# EAGLE design tubeamplights (EAGLE 9.4.2)
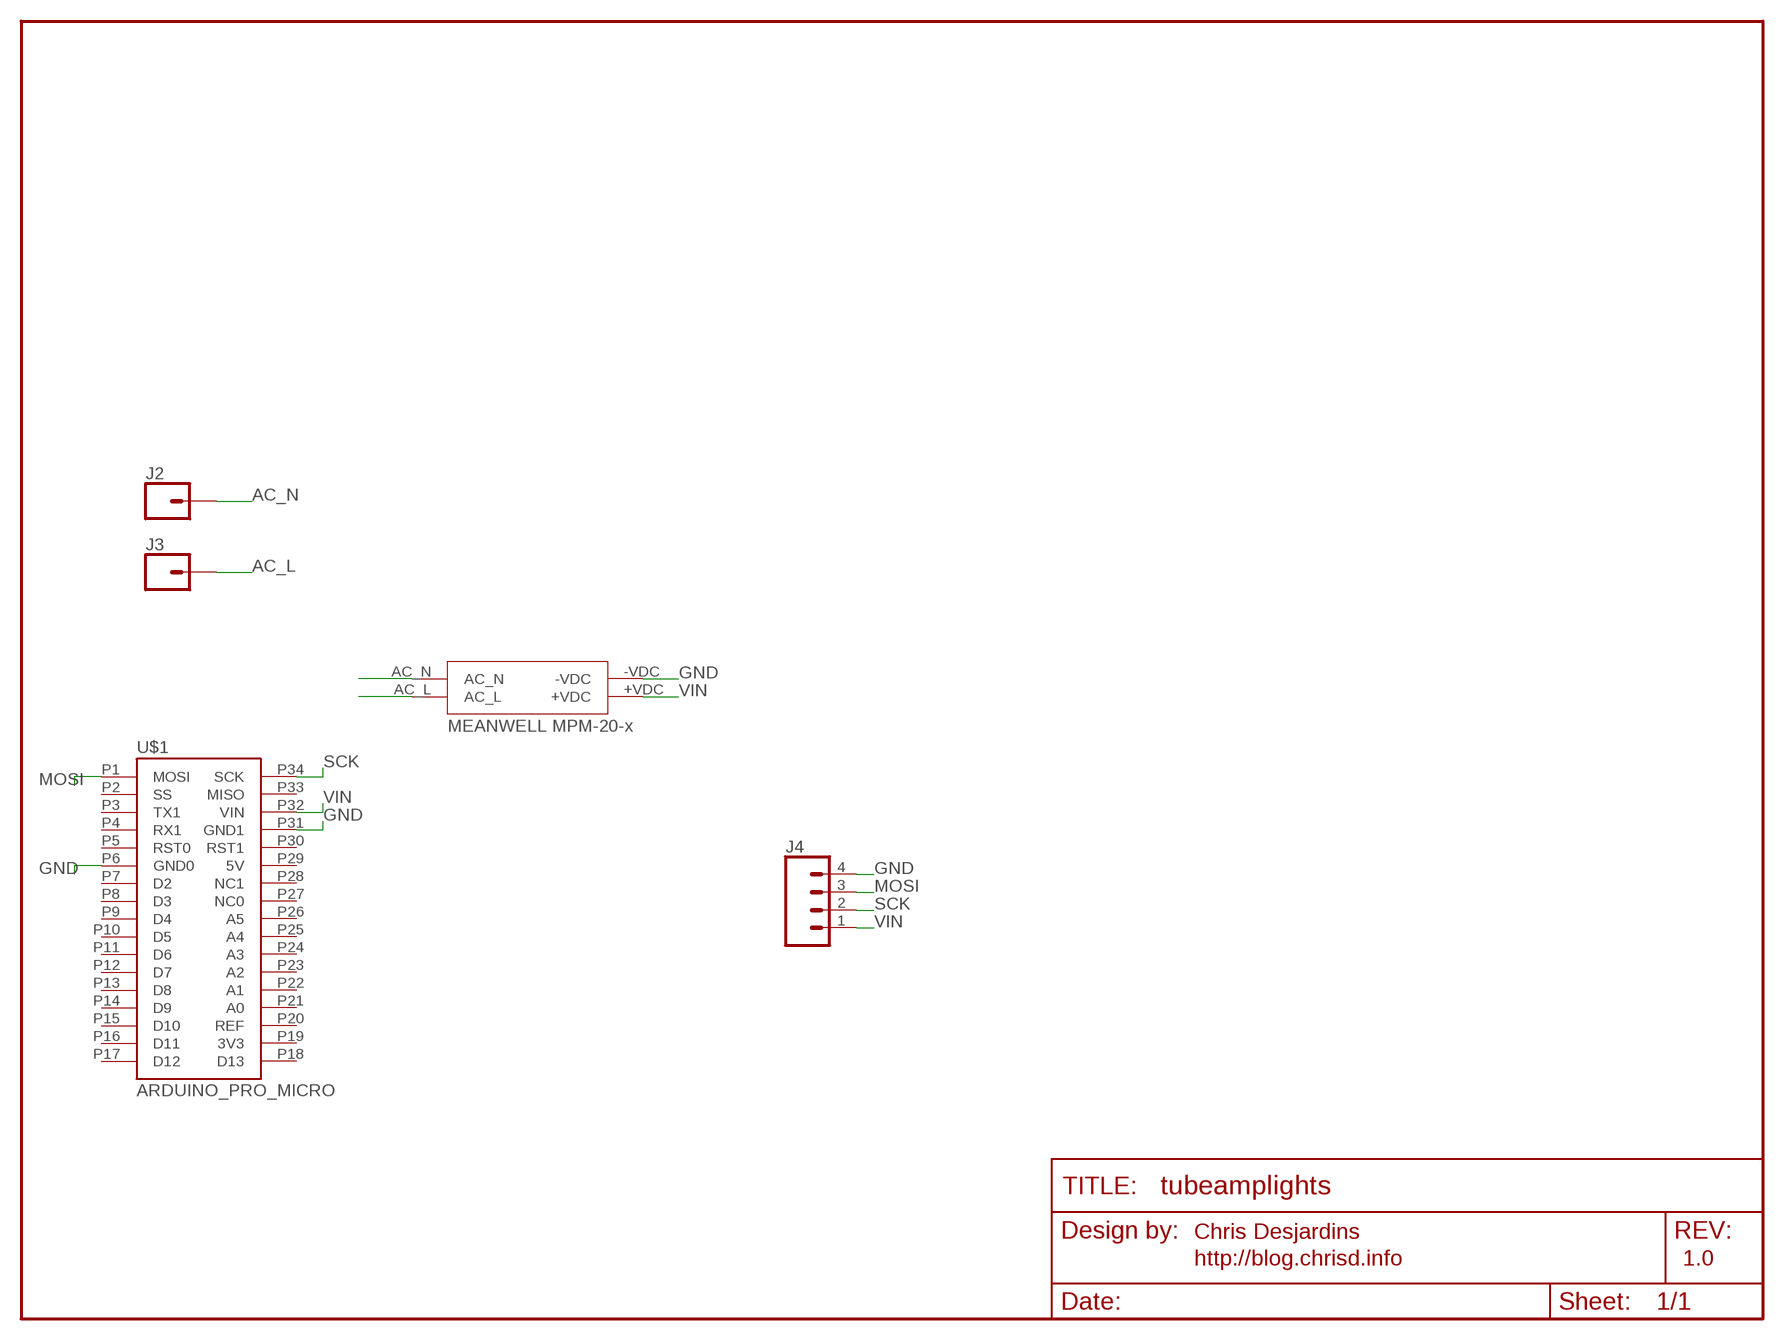
[diagram p0: schematic, sheet 1]

## Parts
J2  CONN_01PTH_2MM  [1X01_2MM]
J3  CONN_01PTH_2MM  [1X01_2MM]
J4  CONN_04  [1X04]
U$1  ARDUINO_PRO_MICRO  [ARDUINO_PRO_MICRO]
U$2  MPM-20-X  [MPM-20-X]

## Nets
AC_L: J3.1 U$2.AC_L
AC_N: J2.1 U$2.AC_N
GND: J4.4 U$1.P6(GND0) U$1.P31(GND1) U$2.-VDC
MOSI: J4.3 U$1.P1(MOSI)
SCK: J4.2 U$1.P34(SCK)
VIN: J4.1 U$1.P32(VIN) U$2.+VDC
Unconnected: U$1.P2(SS) U$1.P3(TX1) U$1.P4(RX1) U$1.P5(RST0) U$1.P7(D2) U$1.P8(D3) U$1.P9(D4) U$1.P10(D5) U$1.P11(D6) U$1.P12(D7) U$1.P13(D8) U$1.P14(D9) U$1.P15(D10) U$1.P16(D11) U$1.P17(D12) U$1.P18(D13) U$1.P21(A0) U$1.P22(A1) U$1.P23(A2) U$1.P24(A3) U$1.P25(A4) U$1.P26(A5) U$1.P27(NC0) U$1.P28(NC1) U$1.P30(RST1) U$1.P33(MISO)

## Notes on the sheet
- Chris Desjardins
- http://blog.chrisd.info | 1.0

## Power pins joined to a net without a drawn wire
3V3: U$1.P19(3V3)
5V: U$1.P29(5V)
REF: U$1.P20(REF)

## Library data of the parts
J2 J3 = SparkFun-Connectors:CONN_01: Single connection point. Often used as Generic Header-pin footprint for 0.1 inch spaced/style header connections On any of the 0.1 inch spaced packages, you can populate with these: Break Away Headers - Straight <https://www.sparkfun.com/products/116> (PRT-00116) Break Away Male Headers - Right Angle <https://www.sparkfun.com/products/553> (PRT-00553) Female Headers <https://www.sparkfun.com/products/115> (PRT-00115) Break Away Headers - Machine Pin <https://www.sparkfun.com/products/117> (PRT-00117) Break Away Female Headers - Swiss Machine Pin <https://www.sparkfun.com/products/743> (PRT-00743) This device is also useful as a general connection point to wire up your design to another part of your project. Our various solder wires solder well into these plated through hole pads. Hook-Up Wire - Assortment (Stranded, 22 AWG) <https://www.sparkfun.com/products/11375> (PRT-11375) Hook-Up Wire - Assortment (Solid Core, 22 AWG) <https://www.sparkfun.com/products/11367> (PRT-11367) View the entire wire category on our website here <https://www.sparkfun.com/categories/141> Special notes: SMTSO-256-ET is a "flush mount" nut for a 4-40 screw. We mostly use this on specialty testbeds; it is a nice way to connect hardware to your PCB at an adjustable hieght. Also note, the SNAP packages are for using a snappable style connector. We sell a baggie of snaps and they are also used on two LilyPad designs: Snap Assortment - 30 pack (male and female) <https://www.sparkfun.com/products/11347> (DEV-11347) LilyPad Arduino SimpleSnap <https://www.sparkfun.com/products/10941> (DEV-10941) LilyPad SimpleSnap Protoboard <https://www.sparkfun.com/products/10940> (DEV-10940)
J4 = SparkFun-Connectors:CONN_04: Multi connection point. Often used as Generic Header-pin footprint for 0.1 inch spaced/style header connections On any of the 0.1 inch spaced packages, you can populate with these: Break Away Headers - Straight <https://www.sparkfun.com/products/116> (PRT-00116) Break Away Male Headers - Right Angle <https://www.sparkfun.com/products/553> (PRT-00553) Female Headers <https://www.sparkfun.com/products/115> (PRT-00115) Break Away Headers - Machine Pin <https://www.sparkfun.com/products/117> (PRT-00117) Break Away Female Headers - Swiss Machine Pin <https://www.sparkfun.com/products/743> (PRT-00743) For SCREWTERMINALS and SPRING TERMINALS visit here: Screw Terimnals on SparkFun.com <https://www.sparkfun.com/search/results?term=Screw+Terminals> (5mm/3.5mm/2.54mm spacing) This device is also useful as a general connection point to wire up your design to another part of your project. Our various solder wires solder well into these plated through hole pads. Hook-Up Wire - Assortment (Stranded, 22 AWG) <https://www.sparkfun.com/products/11375> (PRT-11375) Hook-Up Wire - Assortment (Solid Core, 22 AWG) <https://www.sparkfun.com/products/11367> (PRT-11367) View the entire wire category on our website here <https://www.sparkfun.com/categories/141> Special notes: Molex polarized connector foot print use with SKU : PRT-08231 with associated crimp pins and housings. 1MM SMD Version SKU: PRT-10208; PROD_ID: CONN-09696
U$1 = ChrisD:ARDUINO_PRO_MICRO
U$2 = meanwell-mpm-20-x:MPM-20-X: mpm-20-x line of ac/dc power supplies

## Board
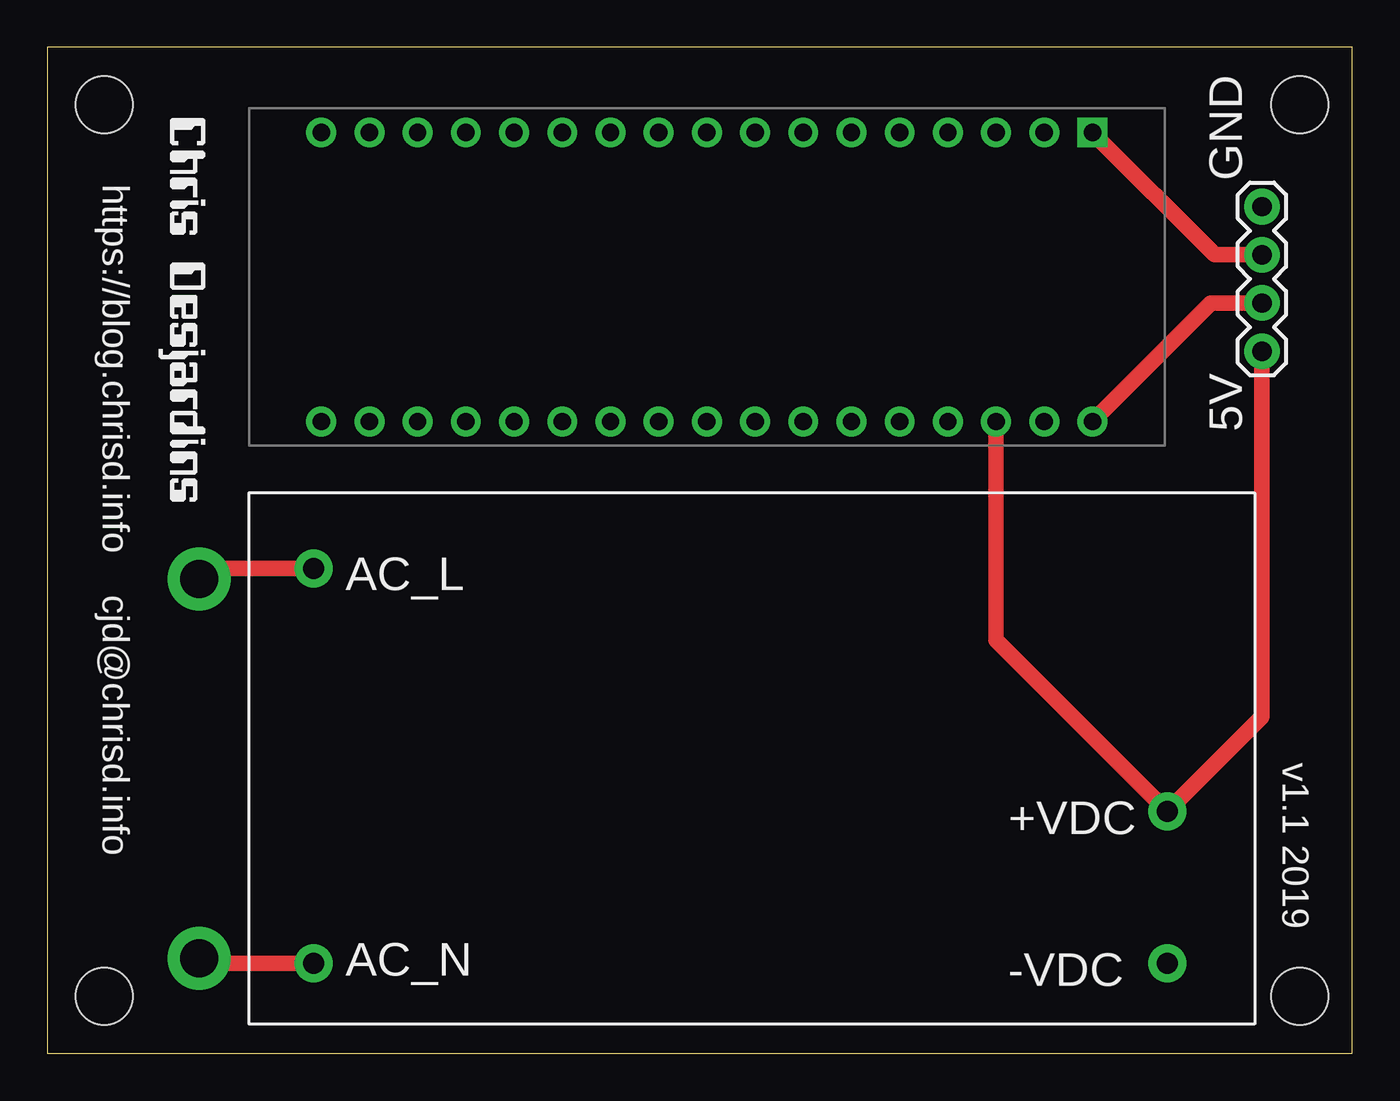
[diagram p1: board, top side]
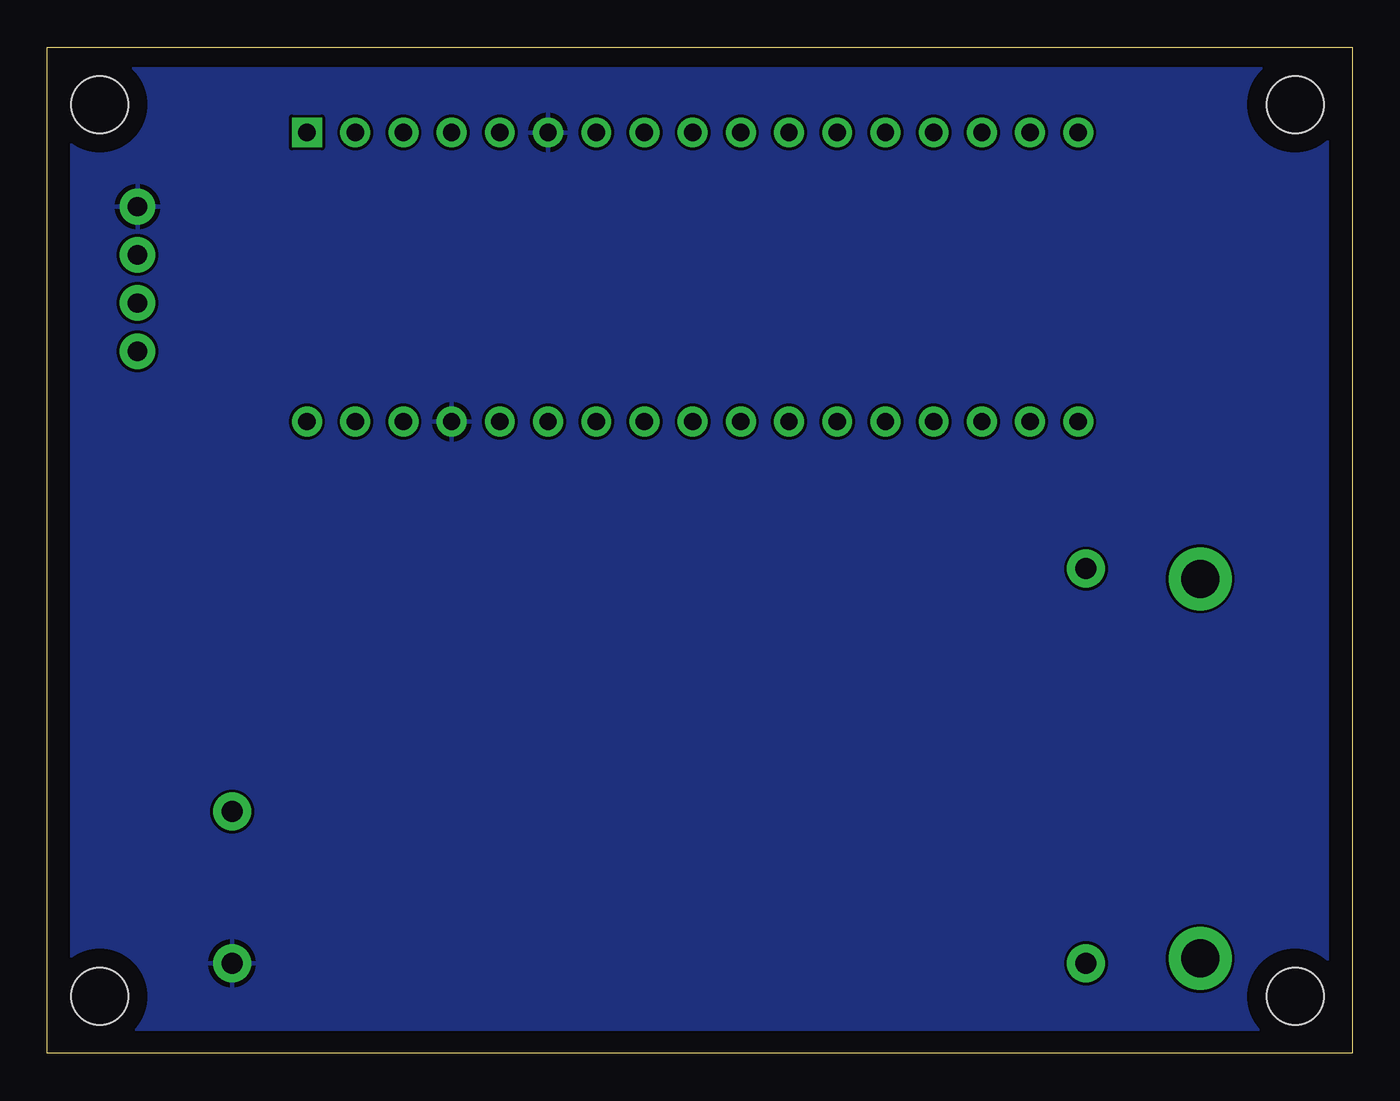
[diagram p2: board, bottom side, seen from below]

Size 68.75 x 53.01 mm. Coordinates in mm from the lower left corner, seen from the top.
Outline: 0,0 68.75,0 68.75,53.01 0,53.01 0,0
Copper layers (1*16): Top 0.035mm / dielectric 1.5mm / Bottom 0.035mm
Design rules "default": minimum track width 6mil, minimum drill 0.35mm, track to track 6mil, track to pad 6mil, pad to pad 6mil, via to via 6mil, smd to smd 6mil, copper to edge 40mil, drill to drill 6mil, minimum pad ring 10mil, minimum via ring 8mil, stop-mask expansion 4mil, vias tented up to drill 0mil, thermal gap 10mil
Holes 3 mm at 66,3 66,50 3,50 3,3

### Footprints (pad centres in the part's own frame; a part is rotated, then mirrored left to right if it is on the bottom)
1X01_2MM = drill 2 pad 3.302: 1 0,0
1X04 = drill 1.016 pad 1.88: 1 0,0; 2 2.54,0; 3 5.08,0; 4 7.62,0
ARDUINO_PRO_MICRO = drill 0.914 pad 1.575 square: P1 1.27,44.45 | drill 0.914 pad 1.575: P2 1.27,41.91; P3 1.27,39.37; P4 1.27,36.83; P5 1.27,34.29; P6 1.27,31.75; P7 1.27,29.21; P8 1.27,26.67; P9 1.27,24.13; P10 1.27,21.59; P11 1.27,19.05; P12 1.27,16.51; P13 1.27,13.97; P14 1.27,11.43; P15 1.27,8.89; P16 1.27,6.35; P17 1.27,3.81; P18 16.51,3.81; P19 16.51,6.35; P20 16.51,8.89; P21 16.51,11.43; P22 16.51,13.97; P23 16.51,16.51; P24 16.51,19.05; P25 16.51,21.59; P26 16.51,24.13; P27 16.51,26.67; P28 16.51,29.21; P29 16.51,31.75; P30 16.51,34.29; P31 16.51,36.83; P32 16.51,39.37; P33 16.51,41.91; P34 16.51,44.45
MPM-20-X = drill 1.1 pad 2: +VDC 48.4,11.2; -VDC 48.4,3.2; AC_L 3.4,24; AC_N 3.4,3.2

### Placement (x,y rotation side)
J2  8,5 0 top
J3  8,25 0 top
J4  64,37 90 top
U$1  10.62,49.8 270 top
U$2  10.62,1.54 0 top
U$3  [LOGO]  6.47,49.37 270 top

### Tracks (layer width: path | path; a pad name or v marks a point on that pad's centre or on a via)
AC_L
  Top 0.813: J3.1 8.54,25.54 U$2.AC_L
AC_N
  Top 0.813: U$2.AC_N 8.26,4.74 J2.1
GND
  pour Bottom: 1.27,1.27 1.27,52.07 67.5,52.07 67.5,1.27
MOSI
  Top 0.813: U$1.P1 61.52,42.08 J4.3
SCK
  Top 0.813: U$1.P34 61.32,39.54 J4.2
VIN
  Top 0.813: J4.1 64,17.72 U$2.+VDC 49.99,21.77 U$1.P32

### Text on the board
tPlace: https://blog.chrisd.info cjd@chrisd.info | GND | 5V | v1.1 2019